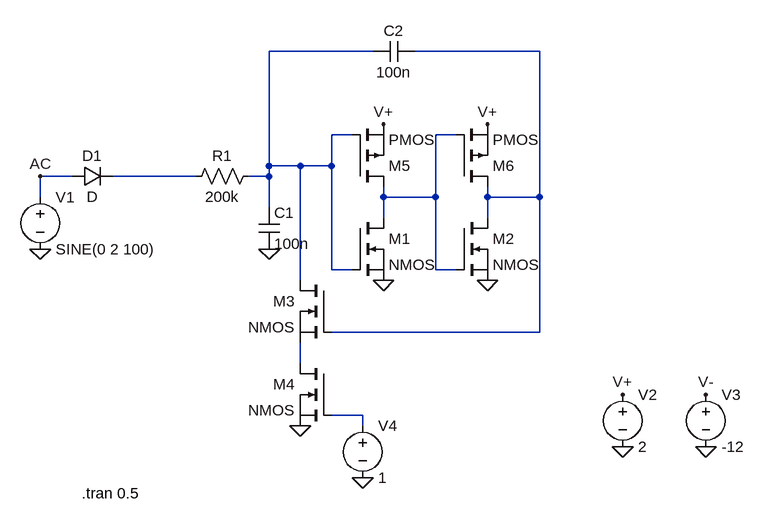
[diagram p0: schematic Axon-Hillock.asc]
Axon-Hillock.asc, the LTspice schematic file:
Version 4
SHEET 1 956 680
WIRE 384 -144 224 -144
WIRE 640 -144 448 -144
WIRE 352 -16 320 -16
WIRE 512 -16 480 -16
WIRE 224 32 224 -144
WIRE 272 32 224 32
WIRE 320 32 320 -16
WIRE 320 32 272 32
WIRE -80 48 -128 48
WIRE 112 48 -16 48
WIRE 224 48 224 32
WIRE 224 48 192 48
WIRE -128 80 -128 48
WIRE 400 80 400 64
WIRE 480 80 480 -16
WIRE 480 80 400 80
WIRE 560 80 560 64
WIRE 640 80 640 -144
WIRE 640 80 560 80
WIRE 224 96 224 48
WIRE 400 112 400 80
WIRE 560 112 560 80
WIRE 320 192 320 32
WIRE 352 192 320 192
WIRE 480 192 480 80
WIRE 512 192 480 192
WIRE 272 208 272 32
WIRE 640 288 640 80
WIRE 640 288 320 288
WIRE 272 336 272 304
WIRE 368 416 320 416
WIRE 368 432 368 416
FLAG -128 160 0
FLAG 368 512 0
FLAG 768 464 0
FLAG 896 464 0
FLAG 768 384 V+
FLAG 896 384 V-
FLAG 224 160 0
FLAG 400 -32 V+
FLAG 560 -32 V+
FLAG 560 208 0
FLAG 400 208 0
FLAG -128 48 AC
FLAG 272 432 0
SYMBOL voltage -128 64 R0
WINDOW 123 0 0 Left 2
WINDOW 39 0 0 Left 2
SYMATTR InstName V1
SYMATTR Value SINE(0 2 100)
SYMBOL res 208 32 R90
WINDOW 0 0 56 VBottom 2
WINDOW 3 32 56 VTop 2
SYMATTR InstName R1
SYMATTR Value 200k
SYMBOL cap 208 96 R0
SYMATTR InstName C1
SYMATTR Value 100n
SYMBOL cap 448 -160 R90
WINDOW 0 0 32 VBottom 2
WINDOW 3 32 32 VTop 2
SYMATTR InstName C2
SYMATTR Value 100n
SYMBOL voltage 768 368 R0
WINDOW 123 0 0 Left 2
WINDOW 39 0 0 Left 2
SYMATTR InstName V2
SYMATTR Value 2
SYMBOL voltage 896 368 R0
WINDOW 123 0 0 Left 2
WINDOW 39 0 0 Left 2
SYMATTR InstName V3
SYMATTR Value -12
SYMBOL voltage 368 416 R0
WINDOW 123 0 0 Left 2
WINDOW 39 0 0 Left 2
SYMATTR InstName V4
SYMATTR Value 1
SYMBOL diode -80 64 R270
WINDOW 0 32 32 VTop 2
WINDOW 3 0 32 VBottom 2
SYMATTR InstName D1
SYMBOL nmos 320 208 M0
SYMATTR InstName M3
SYMBOL nmos 320 336 M0
SYMATTR InstName M4
SYMBOL nmos 352 112 R0
SYMATTR InstName M1
SYMBOL nmos 512 112 R0
SYMATTR InstName M2
SYMBOL pmos 352 64 M180
SYMATTR InstName M5
SYMBOL pmos 512 64 M180
SYMATTR InstName M6
TEXT -64 536 Left 2 !.tran 0.5

The netlist it stands for:
* Axon-Hillock.asc
V1 AC 0 SINE(0 2 100)
R1 N001 N004 200k
C1 N001 0 100n
C2 N002 N001 100n
V2 V+ 0 2
V3 V- 0 -12
V4 N006 0 1
D1 AC N004 D
M3 N001 N002 N005 N005 NMOS
M4 N005 N006 0 0 NMOS
M1 N003 N001 0 0 NMOS
M2 N002 N003 0 0 NMOS
M5 N003 N001 V+ V+ PMOS
M6 N002 N003 V+ V+ PMOS
.model D D
.lib standard.dio
.model NMOS NMOS
.model PMOS PMOS
.lib standard.mos
.tran 0.5
.backanno
.end